# EAGLE design TPA3255 (EAGLE 9.2.2)
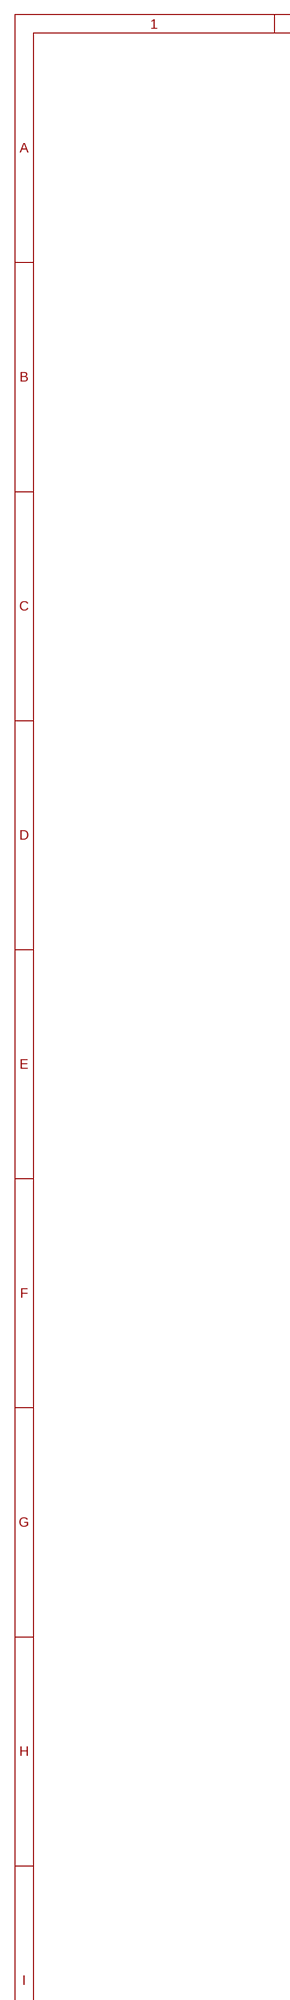
[diagram p0: schematic, sheet 1, part 1 of 2]
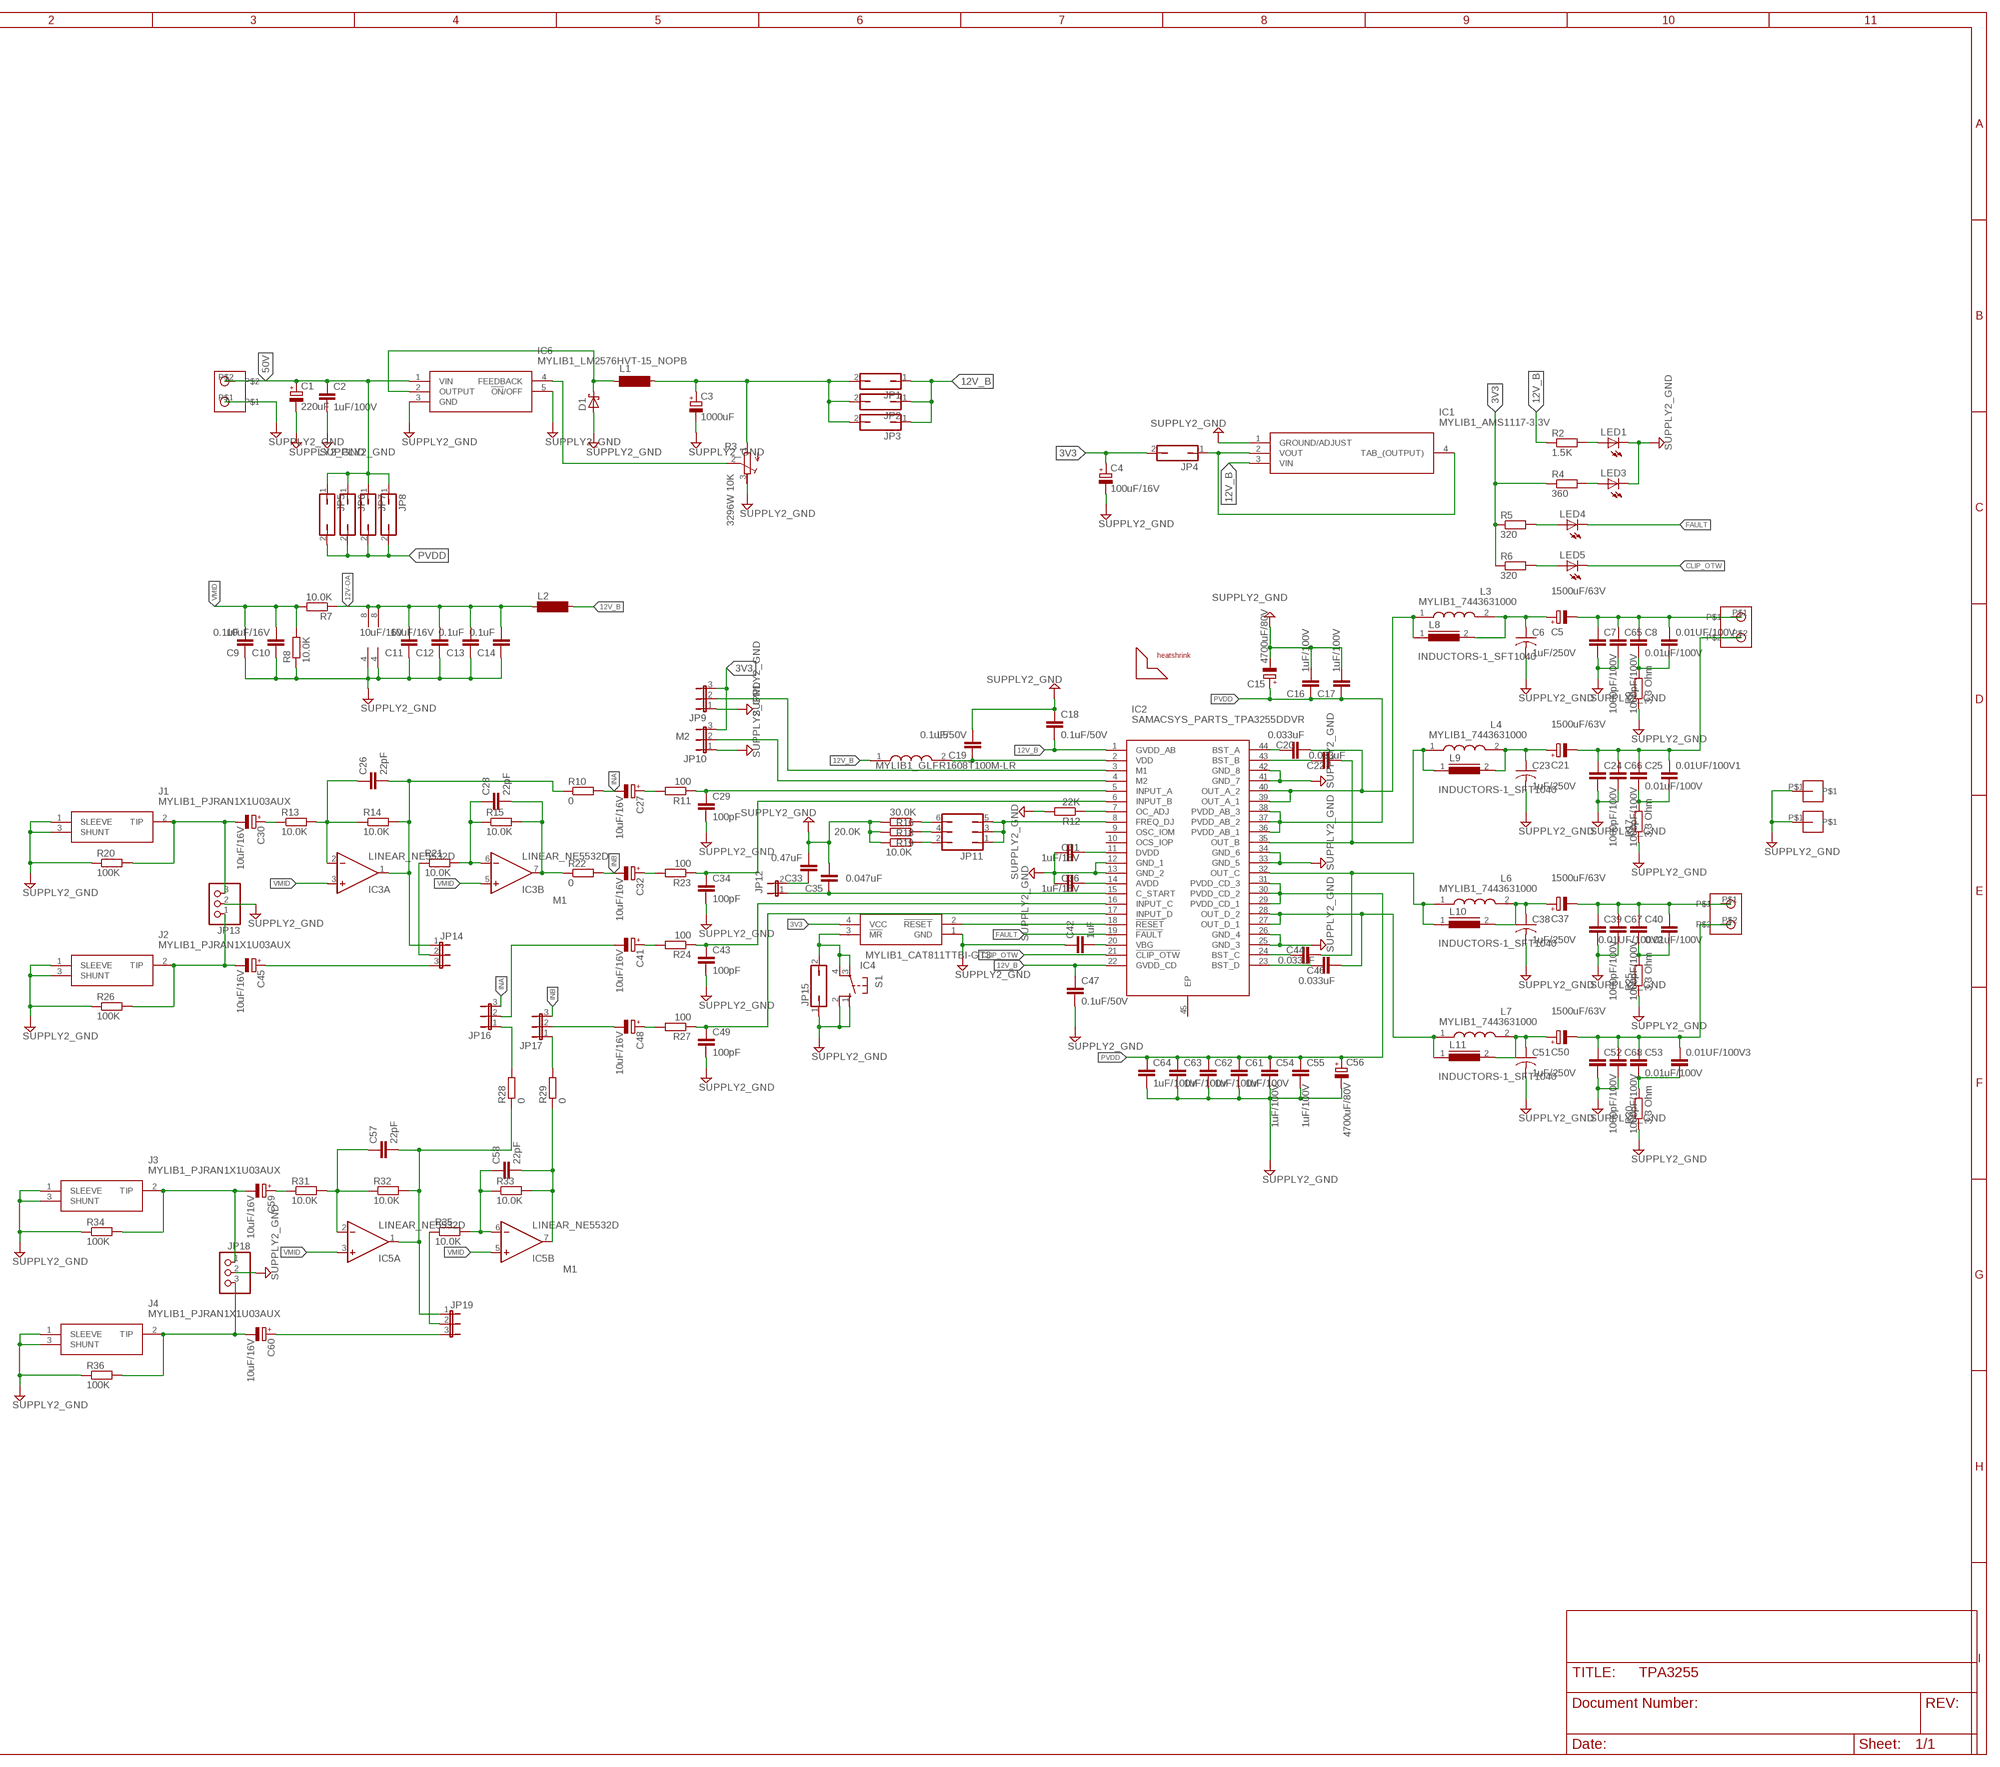
[diagram p1: schematic, sheet 1, part 2 of 2]

## Parts
0.01UF/100V  RCL_C-EU102-054X133  [RCL_C102-054X133]
0.01UF/100V1  RCL_C-EU102-054X133  [RCL_C102-054X133]
0.01UF/100V2  RCL_C-EU102-054X133  [RCL_C102-054X133]
0.01UF/100V3  RCL_C-EU102-054X133  [RCL_C102-054X133]
C1  220uF  RCL_CPOL-EUE7.5-18  [RCL_E7,5-18]
C2  1uF/100V  RCL_C-EU150-054X183  [RCL_C150-054X183]
C3  1000uF  RCL_CPOL-EUE5-10.5  [RCL_E5-10,5]
C4  100uF/16V  RESISTOR_CPOL-EUB:1  [RESISTOR_PANASONIC_B:1]
C5  1500uF/63V  RCL_CPOL-EUE10-22.5  [RCL_EB22,5D]
C6  1uF/250V  RCL_C-US225-108X268  [RCL_C225-108X268]
C7  1000pF/100V  RCL_C-EUC1206  [RCL_C1206]
C8  0.01uF/100V  RCL_C-EUC0603  [RCL_C0603]
C9  0.1uF  RCL_C-EUC0805  [RCL_C0805]
C10  10uF/16V  RCL_C-EUC0805  [RCL_C0805]
C11  10uF/16V  RCL_C-EUC0805  [RCL_C0805]
C12  10uF/16V  RCL_C-EUC0805  [RCL_C0805]
C13  0.1uF  RCL_C-EUC0805  [RCL_C0805]
C14  0.1uF  RCL_C-EUC0805  [RCL_C0805]
C15  4700uF/80V  RCL_CPOL-EUE10-35  [RCL_EB35D]
C16  1uF/100V  RCL_C-EU150-054X183  [RCL_C150-054X183]
C17  1uF/100V  RCL_C-EU150-054X183  [RCL_C150-054X183]
C18  0.1uF/50V  RCL_C-EUC0603  [RCL_C0603]
C19  0.1uF/50V  RCL_C-EUC0603  [RCL_C0603]
C20  0.033uF  RCL_C-EUC0603K  [RCL_C0603K]
C21  1500uF/63V  RCL_CPOL-EUE10-22.5  [RCL_EB22,5D]
C22  0.033uF  RCL_C-EUC0603K  [RCL_C0603K]
C23  1uF/250V  RCL_C-US225-108X268  [RCL_C225-108X268]
C24  1000pF/100V  RCL_C-EUC1206  [RCL_C1206]
C25  0.01uF/100V  RCL_C-EUC0603  [RCL_C0603]
C26  22pF  RCL_C-EUC0805  [RCL_C0805]
C27  10uF/16V  RCL_CPOL-EUB  [RCL_PANASONIC_B]
C28  22pF  RCL_C-EUC0805  [RCL_C0805]
C29  100pF  RCL_C-EUC0805  [RCL_C0805]
C30  10uF/16V  RCL_CPOL-EUB  [RCL_PANASONIC_B]
C31  1uF/16V  RCL_C-EUC0603  [RCL_C0603]
C32  10uF/16V  RCL_CPOL-EUB  [RCL_PANASONIC_B]
C33  0.47uF  RCL_C-EUC0603  [RCL_C0603]
C34  100pF  RCL_C-EUC0805  [RCL_C0805]
C35  0.047uF  RCL_C-EUC0805  [RCL_C0805]
C36  1uF/16V  RCL_C-EUC0603  [RCL_C0603]
C37  1500uF/63V  RCL_CPOL-EUE10-22.5  [RCL_EB22,5D]
C38  1uF/250V  RCL_C-US225-108X268  [RCL_C225-108X268]
C39  1000pF/100V  RCL_C-EUC1206  [RCL_C1206]
C40  0.01uF/100V  RCL_C-EUC0603  [RCL_C0603]
C41  10uF/16V  RCL_CPOL-EUB  [RCL_PANASONIC_B]
C42  1uF  RESISTOR_C-EUC0603:1  [RESISTOR_C0603:1]
C43  100pF  RCL_C-EUC0805  [RCL_C0805]
C44  0.033uF  RCL_C-EUC0603K  [RCL_C0603K]
C45  10uF/16V  RCL_CPOL-EUB  [RCL_PANASONIC_B]
C46  0.033uF  RCL_C-EUC0603K  [RCL_C0603K]
C47  0.1uF/50V  RCL_C-EUC0603  [RCL_C0603]
C48  10uF/16V  RCL_CPOL-EUB  [RCL_PANASONIC_B]
C49  100pF  RCL_C-EUC0805  [RCL_C0805]
C50  1500uF/63V  RCL_CPOL-EUE10-22.5  [RCL_EB22,5D]
C51  1uF/250V  RCL_C-US225-108X268  [RCL_C225-108X268]
C52  1000pF/100V  RCL_C-EUC1206  [RCL_C1206]
C53  0.01uF/100V  RCL_C-EUC0603  [RCL_C0603]
C54  1uF/100V  RCL_C-EU150-054X183  [RCL_C150-054X183]
C55  1uF/100V  RCL_C-EU150-054X183  [RCL_C150-054X183]
C56  4700uF/80V  RCL_CPOL-EUE10-35  [RCL_EB35D]
C57  22pF  RCL_C-EUC0805  [RCL_C0805]
C58  22pF  RCL_C-EUC0805  [RCL_C0805]
C59  10uF/16V  RCL_CPOL-EUB  [RCL_PANASONIC_B]
C60  10uF/16V  RCL_CPOL-EUB  [RCL_PANASONIC_B]
C61  1uF/100V  RCL_C-EUC1206  [RCL_C1206]
C62  1uF/100V  RCL_C-EUC1206  [RCL_C1206]
C63  1uF/100V  RCL_C-EUC1206  [RCL_C1206]
C64  1uF/100V  RCL_C-EUC1206  [RCL_C1206]
C65  1000pF/100V  RCL_C-EU050-025X075  [RCL_C050-025X075]
C66  1000pF/100V  RCL_C-EU050-025X075  [RCL_C050-025X075]
C67  1000pF/100V  RCL_C-EU050-025X075  [RCL_C050-025X075]
C68  1000pF/100V  RCL_C-EU050-025X075  [RCL_C050-025X075]
D1  DIODE_SCHOTTKY-DIODESMD  [DIODE_SMB]
H1  28x28mm  MYLIB1_HEATSHRINK-28X28MM  [MYLIB1_HEATSHRINK-28X28MM]
IC1  MYLIB1_AMS1117-3.3V  [MYLIB1_SOT229P700X180-4N]
IC2  SAMACSYS_PARTS_TPA3255DDVR  [SAMACSYS_PARTS_SOP64P810X120-45N]
IC3  LINEAR_NE5532D  [LINEAR_SO08]
IC4  MYLIB1_CAT811TTBI-GT3  [MYLIB1_4-PIN-SOT-143(BI-SUFFIX-CASE-5]
IC5  LINEAR_NE5532D  [LINEAR_SO08]
IC6  MYLIB1_LM2576HVT-15_NOPB  [MYLIB1_LM2576HVT15NOPB]
J1  MYLIB1_PJRAN1X1U03AUX  [MYLIB1_PJRAN1X1U03AUX]
J2  MYLIB1_PJRAN1X1U03AUX  [MYLIB1_PJRAN1X1U03AUX]
J3  MYLIB1_PJRAN1X1U03AUX  [MYLIB1_PJRAN1X1U03AUX]
J4  MYLIB1_PJRAN1X1U03AUX  [MYLIB1_PJRAN1X1U03AUX]
JP1  JUMPER_JP1Q  [JUMPER_JP1]
JP2  JUMPER_JP1Q  [JUMPER_JP1]
JP3  JUMPER_JP1Q  [JUMPER_JP1]
JP4  JUMPER_JP1Q  [JUMPER_JP1]
JP5  JUMPER_JP1Q  [JUMPER_JP1]
JP6  JUMPER_JP1Q  [JUMPER_JP1]
JP7  JUMPER_JP1Q  [JUMPER_JP1]
JP8  JUMPER_JP1Q  [JUMPER_JP1]
JP9  JUMPER_JP2E  [JUMPER_JP2]
JP10  JUMPER_JP2E  [JUMPER_JP2]
JP11  JUMPER_JP3Q  [JUMPER_JP3Q]
JP12  JUMPER_JP1E  [JUMPER_JP1]
JP13  PINHEAD_PINHD-1X3  [PINHEAD_1X03]
JP14  JUMPER_JP2E  [JUMPER_JP2]
JP15  JUMPER_JP1Q  [JUMPER_JP1]
JP16  JUMPER_JP2E  [JUMPER_JP2]
JP17  JUMPER_JP2E  [JUMPER_JP2]
JP18  PINHEAD_PINHD-1X3  [PINHEAD_1X03]
JP19  JUMPER_JP2E  [JUMPER_JP2]
L1  INDUCTOR-NEOSID_BS11  [INDUCTOR-NEOSID_BS11]
L2  INDUCTOR-NEOSID_BS11  [INDUCTOR-NEOSID_BS11]
L3  MYLIB1_7443631000  [MYLIB1_WE-HCF_201322]
L4  MYLIB1_7443631000  [MYLIB1_WE-HCF_201322]
L5  MYLIB1_GLFR1608T100M-LR  [MYLIB1_INDC1608X100N]
L6  MYLIB1_7443631000  [MYLIB1_WE-HCF_201322]
L7  MYLIB1_7443631000  [MYLIB1_WE-HCF_201322]
L8  INDUCTORS-1_SFT1040  [INDUCTORS-1_SFT1040]
L9  INDUCTORS-1_SFT1040  [INDUCTORS-1_SFT1040]
L10  INDUCTORS-1_SFT1040  [INDUCTORS-1_SFT1040]
L11  INDUCTORS-1_SFT1040  [INDUCTORS-1_SFT1040]
LED1  LED_LEDCHIP-LED0805  [LED_CHIP-LED0805]
LED3  LED_LEDCHIP-LED0805  [LED_CHIP-LED0805]
LED4  LED_LEDCHIP-LED0805  [LED_CHIP-LED0805]
LED5  LED_LEDCHIP-LED0805  [LED_CHIP-LED0805]
R2  1.5K  RCL_R-EU_M0805  [RCL_M0805]
R3  3296W 10K  RCL_R-TRIMM3296W  [RCL_RTRIM3296W]
R4  360  RCL_R-EU_M0805  [RCL_M0805]
R5  320  RCL_R-EU_M0805  [RCL_M0805]
R6  320  RCL_R-EU_M0805  [RCL_M0805]
R7  10.0K  RESISTOR_R-EU_M0805:1  [RESISTOR_M0805:1]
R8  10.0K  RESISTOR_R-EU_M0805:1  [RESISTOR_M0805:1]
R9  3.3 Ohm  RESISTOR_R-EU_R0805:1  [RESISTOR_R0805:1]
R10  0  RESISTOR_R-EU_M0805:1  [RESISTOR_M0805:1]
R11  100  RCL_R-EU_M0805  [RCL_M0805]
R12  22K  RCL_R-EU_M0805  [RCL_M0805]
R13  10.0K  RESISTOR_R-EU_M0805:1  [RESISTOR_M0805:1]
R14  10.0K  RESISTOR_R-EU_M0805:1  [RESISTOR_M0805:1]
R15  10.0K  RESISTOR_R-EU_M0805:1  [RESISTOR_M0805:1]
R16  30.0K  RCL_R-EU_R0805  [RCL_R0805]
R17  3.3 Ohm  RESISTOR_R-EU_R0805:1  [RESISTOR_R0805:1]
R18  20.0K  RESISTOR_R-EU_R0603:1  [RESISTOR_R0603:1]
R19  10.0K  RCL_R-EU_R0805  [RCL_R0805]
R20  100K  RESISTOR_R-EU_M0805:1  [RESISTOR_M0805:1]
R21  10.0K  RESISTOR_R-EU_M0805:1  [RESISTOR_M0805:1]
R22  0  RESISTOR_R-EU_M0805:1  [RESISTOR_M0805:1]
R23  100  RCL_R-EU_M0805  [RCL_M0805]
R24  100  RCL_R-EU_M0805  [RCL_M0805]
R25  3.3 Ohm  RESISTOR_R-EU_R0805:1  [RESISTOR_R0805:1]
R26  100K  RESISTOR_R-EU_M0805:1  [RESISTOR_M0805:1]
R27  100  RCL_R-EU_M0805  [RCL_M0805]
R28  0  RESISTOR_R-EU_M0805:1  [RESISTOR_M0805:1]
R29  0  RESISTOR_R-EU_M0805:1  [RESISTOR_M0805:1]
R30  3.3 Ohm  RESISTOR_R-EU_R0805:1  [RESISTOR_R0805:1]
R31  10.0K  RESISTOR_R-EU_M0805:1  [RESISTOR_M0805:1]
R32  10.0K  RESISTOR_R-EU_M0805:1  [RESISTOR_M0805:1]
R33  10.0K  RESISTOR_R-EU_M0805:1  [RESISTOR_M0805:1]
R34  100K  RESISTOR_R-EU_M0805:1  [RESISTOR_M0805:1]
R35  10.0K  RESISTOR_R-EU_M0805:1  [RESISTOR_M0805:1]
R36  100K  RESISTOR_R-EU_M0805:1  [RESISTOR_M0805:1]
S1  SWITCH-OMRON_10-XX  [SWITCH-OMRON_B3F-10XX]
T1  MYLIB1_5MM-2PIN-TERMINAL  [MYLIB1_3MM-2PIN-TERMINAL]
T2  MYLIB1_5MM-2PIN-TERMINAL  [MYLIB1_3MM-2PIN-TERMINAL]
T4  MYLIB1_5MM-2PIN-TERMINAL  [MYLIB1_3MM-2PIN-TERMINAL]
U$1  MYLIB1_5MM-1PIN-TERMINAL  [MYLIB1_5MM-1PIN-TERMINAL]
U$2  MYLIB1_5MM-1PIN-TERMINAL  [MYLIB1_5MM-1PIN-TERMINAL]

## Nets
3V3: C4.+ IC4.4(VCC) JP4.2 JP9.3 JP10.3 R4.1 R5.1 R6.1
12V: C3.+ JP1.2 JP2.2 JP3.2 L1.2 R3.1(A)
12V-OA: C11.2 C12.2 C13.2 C14.2 IC3.8(P:V+) IC5.8(P:V+) L2.1 R7.1
12V_B: C18.2 C47.1 IC1.3(VIN) IC2.1(GVDD_AB) IC2.22(GVDD_CD) JP1.1 JP2.1 JP3.1 L2.2 L5.1 R2.1
50V: C1.+ C2.1 IC6.1(VIN) JP5.1 JP6.1 JP7.1 JP8.1 T1.P$2
CLIP_OTW: IC2.21(!CLIP_OTW) LED5.C
FAULT: IC2.19(!FAULT) LED4.C
GND: C1.- C2.2 C3.- C4.- C6.2 C7.2 C9.1 C10.1 C11.1 C12.1 C13.1 C14.1 C15.- C16.2 C17.2 C18.1 C19.2 C23.2 C24.2 C29.2 C31.1 C33.2 C34.2 C35.2 C36.1 C38.2 C39.2 C42.1 C43.2 C47.2 C49.2 C51.2 C52.2 C54.2 C55.2 C56.- C61.2 C62.2 C63.2 C64.2 C65.2 C66.2 C67.2 C68.2 D1.A IC1.1(GROUND/ADJUST) IC2.12(GND_1) IC2.13(GND_2) IC2.25(GND_3) IC2.26(GND_4) IC2.33(GND_5) IC2.34(GND_6) IC2.41(GND_7) IC2.42(GND_8) IC3.4(P:V-) IC4.1(GND) IC5.4(P:V-) IC6.3(GND) IC6.5(!ON!/OFF) J1.1(SLEEVE) J1.3(SHUNT) J2.1(SLEEVE) J2.3(SHUNT) J3.1(SLEEVE) J3.3(SHUNT) J4.1(SLEEVE) J4.3(SHUNT) JP9.1 JP10.1 JP13.2 JP15.1 JP18.2 LED1.C LED3.C R3.3(E) R8.1 R9.1 R12.2 R16.1 R17.1 R18.1 R19.1 R20.1 R25.1 R26.1 R30.1 R34.1 R36.1 S1.1(S) S1.2(S1) T1.P$1 U$1.P$1 U$2.P$1 ; supply symbol labelled SUPPLY2_GND
INA: C27.- JP16.3 R10.2
INB: C32.- JP17.3 R22.2
N$1: C34.1 IC2.6(INPUT_B) R23.1
N$2: C43.1 IC2.16(INPUT_C) R24.1
N$3: C49.1 IC2.17(INPUT_D) R27.1
N$4: IC2.3(M1) JP9.2
N$5: C29.1 IC2.5(INPUT_A) R11.1
N$6: IC2.4(M2) JP10.2
N$7: C35.1 IC2.15(C_START) JP12.1
N$8: IC2.7(OC_ADJ) R12.1
N$9: C33.1 JP12.2
N$10: IC4.3(!MR) JP15.2 S1.3(P) S1.4(P1)
N$11: LED4.A R5.2
N$12: LED5.A R6.2
N$13: C42.2 IC2.20(VBG)
N$14: C44.1 IC2.24(BST_C)
N$15: C46.1 IC2.23(BST_D)
N$16: C22.1 IC2.43(BST_B)
N$17: IC2.18(!RESET) IC4.2(!RESET)
N$18: C20.1 IC2.44(BST_A)
N$19: 0.01UF/100V.2 C8.2 R9.2
N$20: C5.+ C6.1 L3.2 L8.2
N$21: 0.01UF/100V.1 C5.- C7.1 C8.1 C65.1 T2.P$1
N$22: C20.2 IC2.39(OUT_A_1) IC2.40(OUT_A_2) L3.1 L8.1
N$23: 0.01UF/100V1.2 C25.2 R17.2
N$24: C21.+ C23.1 L4.2 L9.2
N$25: 0.01UF/100V1.1 C21.- C24.1 C25.1 C66.1 T2.P$2
N$26: C22.2 IC2.35(OUT_B) L4.1 L9.1
N$27: 0.01UF/100V2.1 C40.2 R25.2
N$28: C37.+ C38.1 L6.2 L10.2
N$29: 0.01UF/100V2.2 C37.- C39.1 C40.1 C67.1 T4.P$1
N$30: JP11.6 R16.2
N$31: 0.01UF/100V3.2 C53.2 R30.2
N$32: C50.+ C51.1 L7.2 L11.2
N$33: 0.01UF/100V3.1 C50.- C52.1 C53.1 C68.1 T4.P$2
N$34: C44.2 IC2.32(OUT_C) L6.1 L10.1
N$35: C46.2 IC2.27(OUT_D_1) IC2.28(OUT_D_2) L7.1 L11.1
N$36: IC2.8(FREQ_DJ) JP11.1 JP11.3 JP11.5
N$37: JP11.4 R18.2
N$38: JP11.2 R19.2
N$39: C36.2 IC2.14(AVDD)
N$40: C31.2 IC2.11(DVDD)
N$41: C30.+ R13.1
N$42: LED3.A R4.2
N$43: C19.1 IC2.2(VDD) L5.2
N$44: IC1.2(VOUT) IC1.4(TAB_(OUTPUT)) JP4.1
N$45: D1.C IC6.2(OUTPUT) L1.1
N$46: IC6.4(FEEDBACK) R3.2(S)
N$48: LED1.A R2.2
N$49: C45.+ JP14.3
N$50: C26.1 IC3.2(A:-IN) R13.2 R14.1
N$51: C26.2 IC3.1(A:OUT) JP14.1 R10.1 R14.2
N$52: JP14.2 R21.1
N$53: C28.1 IC3.6(B:-IN) R15.1 R21.2
N$54: C28.2 IC3.7(B:OUT) R15.2 R22.1
N$55: JP17.1 R29.2
N$56: C27.+ R11.2
N$57: C48.- JP17.2
N$58: C32.+ R23.2
N$59: C59.+ R31.1
N$60: C57.1 IC5.2(A:-IN) R31.2 R32.1
N$61: C57.2 IC5.1(A:OUT) JP19.1 R28.1 R32.2
N$62: C60.+ JP19.3
N$63: JP19.2 R35.1
N$64: C58.1 IC5.6(B:-IN) R33.1 R35.2
N$65: C58.2 IC5.7(B:OUT) R29.1 R33.2
N$66: JP16.1 R28.2
N$67: C41.- JP16.2
N$68: C48.+ R27.2
N$69: C41.+ R24.2
N$70: C30.- J1.2(TIP) JP13.3 R20.2
N$71: C45.- J2.2(TIP) JP13.1 R26.2
N$72: C59.- J3.2(TIP) JP18.1 R34.2
N$73: C60.- J4.2(TIP) JP18.3 R36.2
PVDD: C15.+ C16.1 C17.1 C54.1 C55.1 C56.+ C61.1 C62.1 C63.1 C64.1 IC2.29(PVDD_CD_1) IC2.30(PVDD_CD_2) IC2.31(PVDD_CD_3) IC2.36(PVDD_AB_1) IC2.37(PVDD_AB_2) IC2.38(PVDD_AB_3) JP5.2 JP6.2 JP7.2 JP8.2
VMID: C9.2 C10.2 IC3.3(A:+IN) IC3.5(B:+IN) IC5.3(A:+IN) IC5.5(B:+IN) R7.2 R8.2
Unconnected: IC2.9(OSC_IOM) IC2.10(OCS_IOP) IC2.45(EP)

## Notes on the sheet
- M2
- M1
- M1

## Library data of the parts
0.01UF/100V 0.01UF/100V1-0.01UF/100V3 C2 C7-C14 C16-C20 C22 C24-C26 C28 C29 C31 C33-C36 C39 C40 C43 C44 C46 C47 C49 C52-C55 C57 C58 C61-C68 = TPA3255:RCL_C-EU: CAPACITOR, European symbol; SPICEPREFIX: C
C1 C3 C5 C15 C21 C27 C30 C32 C37 C41 C45 C48 C50 C56 C59 C60 = TPA3255:RCL_CPOL-EU: POLARIZED CAPACITOR, European symbol; SPICEPREFIX: C
C4 = TPA3255:RESISTOR_CPOL-EU*?:1: POLARIZED CAPACITOR, European symbol
C6 C23 C38 C51 = TPA3255:RCL_C-US: CAPACITOR, American symbol; SPICEPREFIX: C
C42 = TPA3255:RESISTOR_C-EU*?:1: CAPACITOR, European symbol
D1 = TPA3255:DIODE_SCHOTTKY-DIODE: Schottky Diode
H1 = TPA3255:MYLIB1_HEATSHRINK-28X28MM
IC1 = TPA3255:MYLIB1_AMS1117-3.3V: 1A LOW DROPOUT VOLTAGE REGULATOR, SOT-223 Source: Datasheet <http://www.advanced-monolithic.com/pdf/ds1117.pdf>; DESCRIPTION: 1A LOW DROPOUT VOLTAGE REGULATOR, SOT-223; HEIGHT: 1.8mm; MANUFACTURER_NAME: Advanced Monolithic Systems; MANUFACTURER_PART_NUMBER: ams1117-3.3v
IC2 = TPA3255:SAMACSYS_PARTS_TPA3255DDVR: 315W Stereo / 600W Mono PurePath Ultra-HD, Analog-In Class-D Amplifier Source: Datasheet <http://www.ti.com/lit/gpn/tpa3255>; ARROW_PART_NUMBER: TPA3255DDVR; DESCRIPTION: 315W Stereo / 600W Mono PurePath Ultra-HD, Analog-In Class-D Amplifier; HEIGHT: 1.2mm; MANUFACTURER_NAME: Texas Instruments; MANUFACTURER_PART_NUMBER: TPA3255DDVR
IC3 IC5 = TPA3255:LINEAR_NE5532: AUDIO AMPLIFIER
IC4 = TPA3255:MYLIB1_CAT811TTBI-GT3: uP PSU Supervisory IC Vth=3.075V SOT-143 ON Semiconductor CAT811TTBI-GT3, Voltage Supervisor 2.5V, 3V, 3.3V, 5V, Reset Input, 4-Pin SOT-143 Source: Datasheet <http://www.onsemi.com/pub/Collateral/CAT811-D.PDF>; ALLIED_NUMBER: 70339532; ALLIED_PRICE-STOCK: http://www.alliedelec.com/on-semiconductor-cat811ttbi-gt3/70339532/; DESCRIPTION: uP PSU Supervisory IC Vth=3.075V SOT-143 ON Semiconductor CAT811TTBI-GT3, Voltage Supervisor 2.5V, 3V, 3.3V, 5V, Reset Input, 4-Pin SOT-143; HEIGHT: mm; MANUFACTURER_NAME: ON Semiconductor; MANUFACTURER_PART_NUMBER: CAT811TTBI-GT3; MOUSER_PART_NUMBER: 698-CAT811TTBI-GT3; MOUSER_PRICE-STOCK: https://www.mouser.com/Search/Refine.aspx?Keyword=698-CAT811TTBI-GT3; RS_PART_NUMBER: 7893929P; RS_PRICE-STOCK: http://uk.rs-online.com/web/p/products/7893929P
IC6 = TPA3255:MYLIB1_LM2576HVT-15_NOPB: Texas Instruments, LM2576HVT-15/NOPB Step-Down Switching Regulator 3A, 14.25 15.83 V, 5-Pin TO-220 Source: Datasheet <https://componentsearchengine.com/Datasheets/2/LM2576HVT-15_NOPB.pdf>; DESCRIPTION: Texas Instruments, LM2576HVT-15/NOPB Step-Down Switching Regulator 3A, 14.25 15.83 V, 5-Pin TO-220; HEIGHT: 16.11mm; MANUFACTURER_NAME: Texas Instruments; MANUFACTURER_PART_NUMBER: LM2576HVT-15/NOPB; MOUSER_PART_NUMBER: 926-LM2576HVT-15NOPB; MOUSER_PRICE-STOCK: https://www.mouser.com/Search/Refine.aspx?Keyword=926-LM2576HVT-15NOPB; RS_PART_NUMBER: 1628191; RS_PRICE-STOCK: http://uk.rs-online.com/web/p/products/1628191
J1-J4 = TPA3255:MYLIB1_PJRAN1X1U03AUX: RCA Phono Connectors 1 POS RA PHONO JACK Source: Datasheet <http://www.switchcraft.com/Drawings/pjran1x1u__x_series_cd.pdf>; DESCRIPTION: RCA Phono Connectors 1 POS RA PHONO JACK; HEIGHT: 13mm; MANUFACTURER_NAME: Switchcraft; MANUFACTURER_PART_NUMBER: PJRAN1X1U03AUX; MOUSER_PART_NUMBER: 502-PJRAN1X1U03AUX; MOUSER_PRICE-STOCK: https://www.mouser.com/Search/Refine.aspx?Keyword=502-PJRAN1X1U03AUX
JP1-JP8 JP15 = TPA3255:JUMPER_JP1Q: JUMPER
JP9 JP10 JP14 JP16 JP17 JP19 = TPA3255:JUMPER_JP2E: JUMPER
JP11 = TPA3255:JUMPER_JP3Q: JUMPER
JP12 = TPA3255:JUMPER_JP1E: JUMPER
JP13 JP18 = TPA3255:PINHEAD_PINHD-1X3: PIN HEADER
L1 L2 = TPA3255:INDUCTOR-NEOSID_BS: INDUCTOR nominal inductance, magnetically screened; OC_FARNELL: unknown; OC_NEWARK: unknown
L3 L4 L6 L7 = TPA3255:MYLIB1_7443631000: Wurth WE-HCF Series Shielded Wire-wound SMD Inductor with a Ferrite Core, 10 H 15% Flat Wire Winding 23A Idc Source: Datasheet; DESCRIPTION: Wurth WE-HCF Series Shielded Wire-wound SMD Inductor with a Ferrite Core, 10 H 15% Flat Wire Winding 23A Idc; HEIGHT: mm; MANUFACTURER_NAME: Wurth Elektronik; MANUFACTURER_PART_NUMBER: 7443631000; MOUSER_PART_NUMBER: 710-7443631000; MOUSER_PRICE-STOCK: https://www.mouser.com/Search/Refine.aspx?Keyword=710-7443631000; RS_PART_NUMBER: 7445047P; RS_PRICE-STOCK: http://uk.rs-online.com/web/p/products/7445047P
L5 = TPA3255:MYLIB1_GLFR1608T100M-LR: TDK - GLFR1608T100M-LR - POWER LINE IND, 10UH,400MA,20% Source: Datasheet <https://componentsearchengine.com/Datasheets/2/GLFR1608T100M-LR.pdf>; DESCRIPTION: TDK - GLFR1608T100M-LR - POWER LINE IND, 10UH,400MA,20%; HEIGHT: 1mm; MANUFACTURER_NAME: TDK; MANUFACTURER_PART_NUMBER: GLFR1608T100M-LR; MOUSER_PART_NUMBER: 810-GLFR1608T100M-LR; MOUSER_PRICE-STOCK: https://www.mouser.com/Search/Refine.aspx?Keyword=810-GLFR1608T100M-LR; RS_PART_NUMBER: 6446626; RS_PRICE-STOCK: http://uk.rs-online.com/web/p/products/6446626
L8-L11 = TPA3255:INDUCTORS-1_SFT1040: INDUCTOR; SPICEPREFIX: L
LED1 LED3-LED5 = TPA3255:LED_LED: LED OSRAM: - CHIPLED LG R971, LG N971, LY N971, LG Q971, LY Q971, LO R971, LY R971 LH N974, LH R974 LS Q976, LO Q976, LY Q976 LO Q996 - Hyper CHIPLED LW Q18S LB Q993, LB Q99A, LB R99A - SideLED LS A670, LO A670, LY A670, LG A670, LP A670 LB A673, LV A673, LT A673, LW A673 LH A674 LY A675 LS A676, LA A676, LO A676, LY A676, LW A676 LS A679, LY A679, LG A679 - Hyper Micro SIDELED® LS Y876, LA Y876, LO Y876, LY Y876 LT Y87S - SmartLED LW L88C, LW L88S LB L89C, LB L89S, LG L890 LS L89K, LO L89K, LY L89K LS L896, LA L896, LO L896, LY L896 - TOPLED LS T670, LO T670, LY T670, LG T670, LP T670 LSG T670, LSP T670, LSY T670, LOP T670, LYG T670 LG T671, LOG T671, LSG T671 LB T673, LV T673, LT T673, LW T673 LH T674 LS T676, LA T676, LO T676, LY T676, LB T676, LH T676, LSB T676, LW T676 LB T67C, LV T67C, LT T67C, LS T67K, LO T67K, LY T67K, LW E67C LS E67B, LA E67B, LO E67B, LY E67B, LB E67C, LV E67C, LT E67C LW T67C LS T679, LY T679, LG T679 LS T770, LO T770, LY T770, LG T770, LP T770 LB T773, LV T773, LT T773, LW T773 LH T774 LS E675, LA E675, LY E675, LS T675 LS T776, LA T776, LO T776, LY T776, LB T776 LHGB T686 LT T68C, LB T68C - Hyper Mini TOPLED® LB M676 - Mini TOPLED Santana® LG M470 LS M47K, LO M47K, LY M47K Source: http://www.osram.convergy.de LUXEON: - LUMILED® LXK2-PW12-R00, LXK2-PW12-S00, LXK2-PW14-U00, LXK2-PW14-V00 LXK2-PM12-R00, LXK2-PM12-S00, LXK2-PM14-U00 LXK2-PE12-Q00, LXK2-PE12-R00, LXK2-PE12-S00, LXK2-PE14-T00, LXK2-PE14-U00 LXK2-PB12-K00, LXK2-PB12-L00, LXK2-PB12-M00, LXK2-PB14-N00, LXK2-PB14-P00, LXK2-PB14-Q00 LXK2-PR12-L00, LXK2-PR12-M00, LXK2-PR14-Q00, LXK2-PR14-R00 LXK2-PD12-Q00, LXK2-PD12-R00, LXK2-PD12-S00 LXK2-PH12-R00, LXK2-PH12-S00 LXK2-PL12-P00, LXK2-PL12-Q00, LXK2-PL12-R00 Source: www.luxeon.com KINGBRIGHT: KA-3528ASYC Source: www.kingbright.com
R2 R4-R6 R11 R12 R16 R19 R23 R24 R27 = TPA3255:RCL_R-EU_: RESISTOR, European symbol; SPICEPREFIX: R
R3 = TPA3255:RCL_R-TRIMM: Trimm resistor; SPICEMODEL: X; SPICEPREFIXL: POT
R7-R10 R13-R15 R17 R18 R20-R22 R25 R26 R28-R36 = TPA3255:RESISTOR_R-EU_*?:1: RESISTOR, European symbol
S1 = TPA3255:SWITCH-OMRON_10-XX: OMRON SWITCH; MPN: B3F-1000; OC_FARNELL: 176432; OC_NEWARK: 36M3542
T1 T2 T4 = TPA3255:MYLIB1_5MM-2PIN-TERMINAL
U$1 U$2 = TPA3255:MYLIB1_5MM-1PIN-TERMINAL

## Board
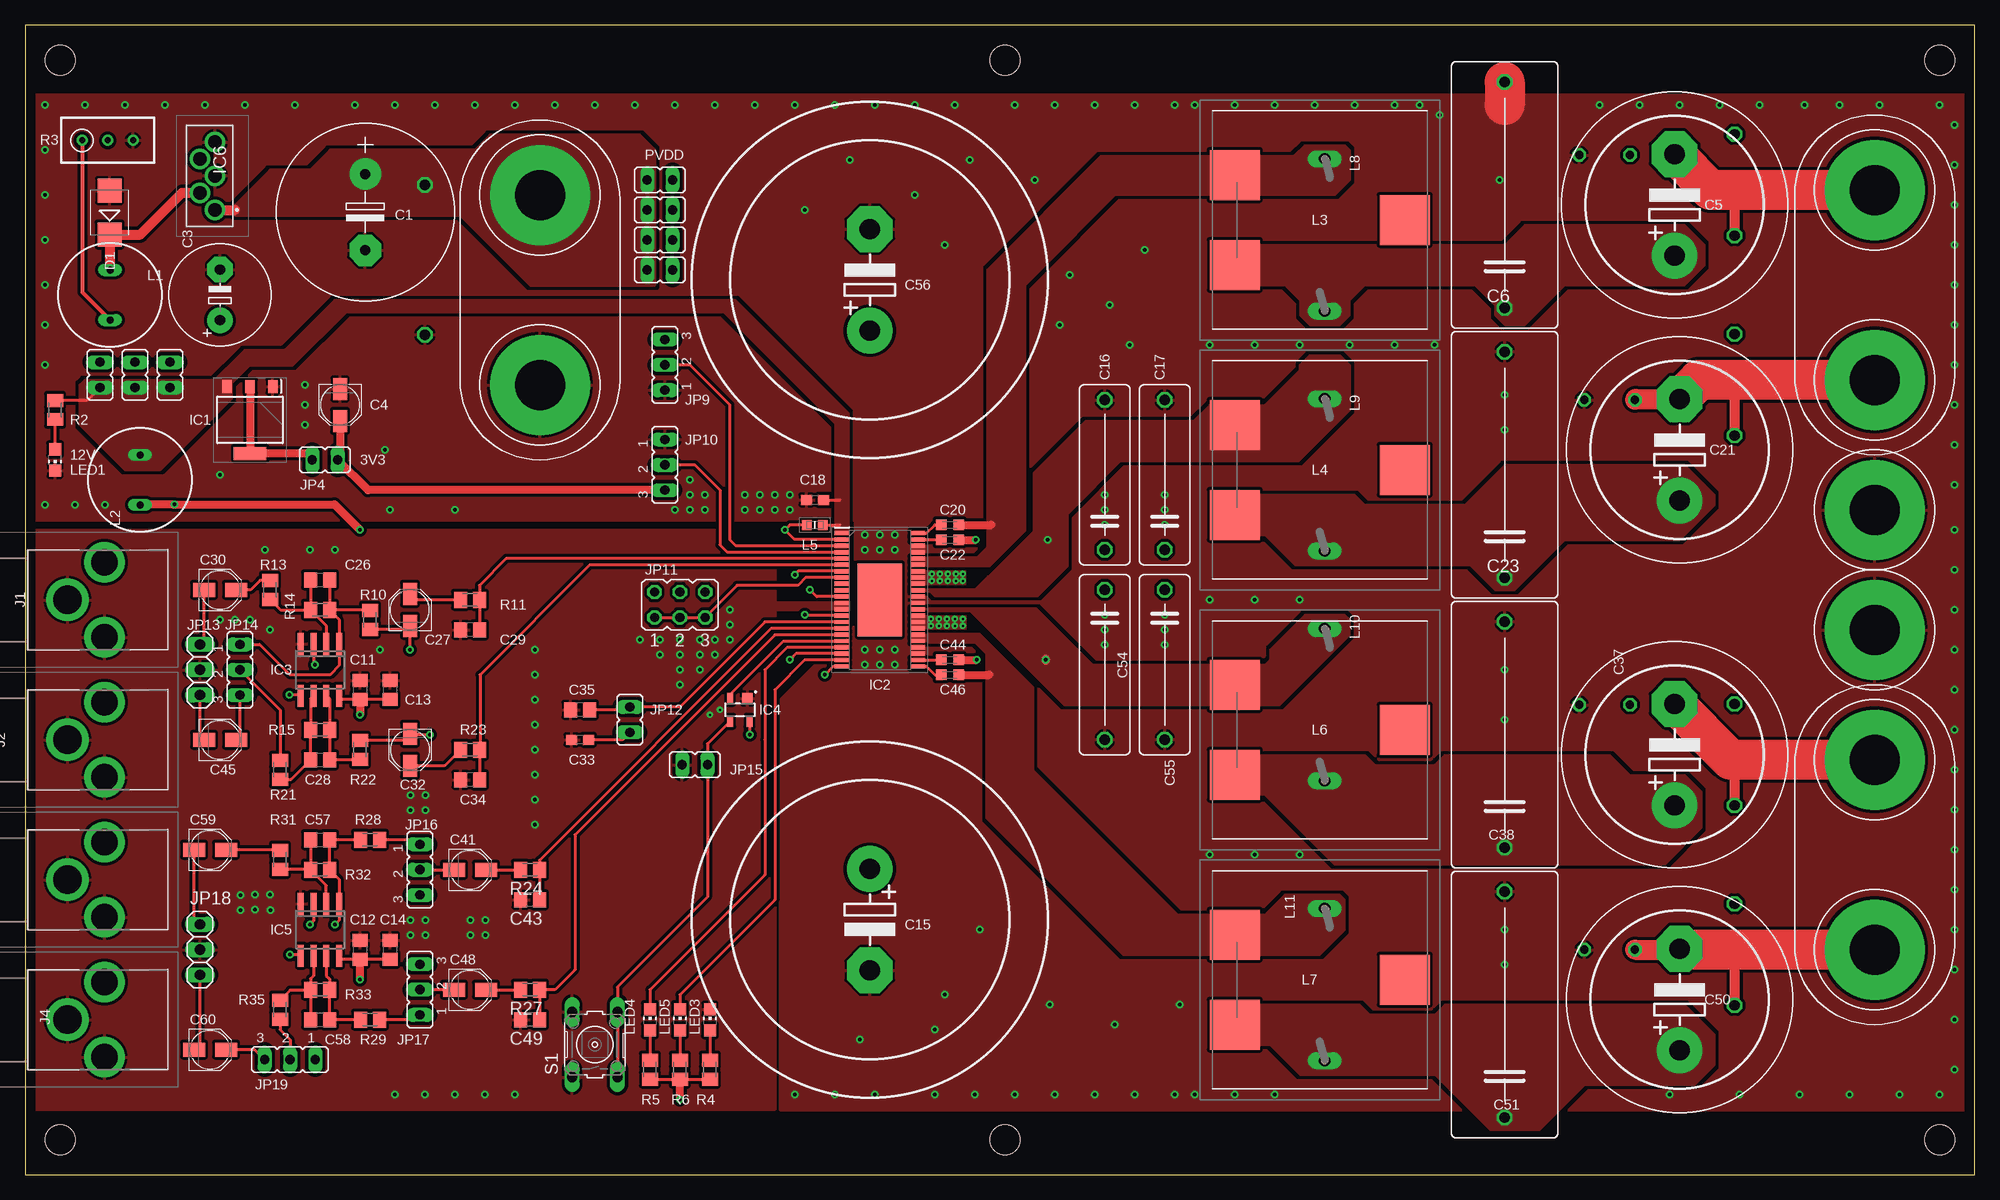
[diagram p2: board, top side]
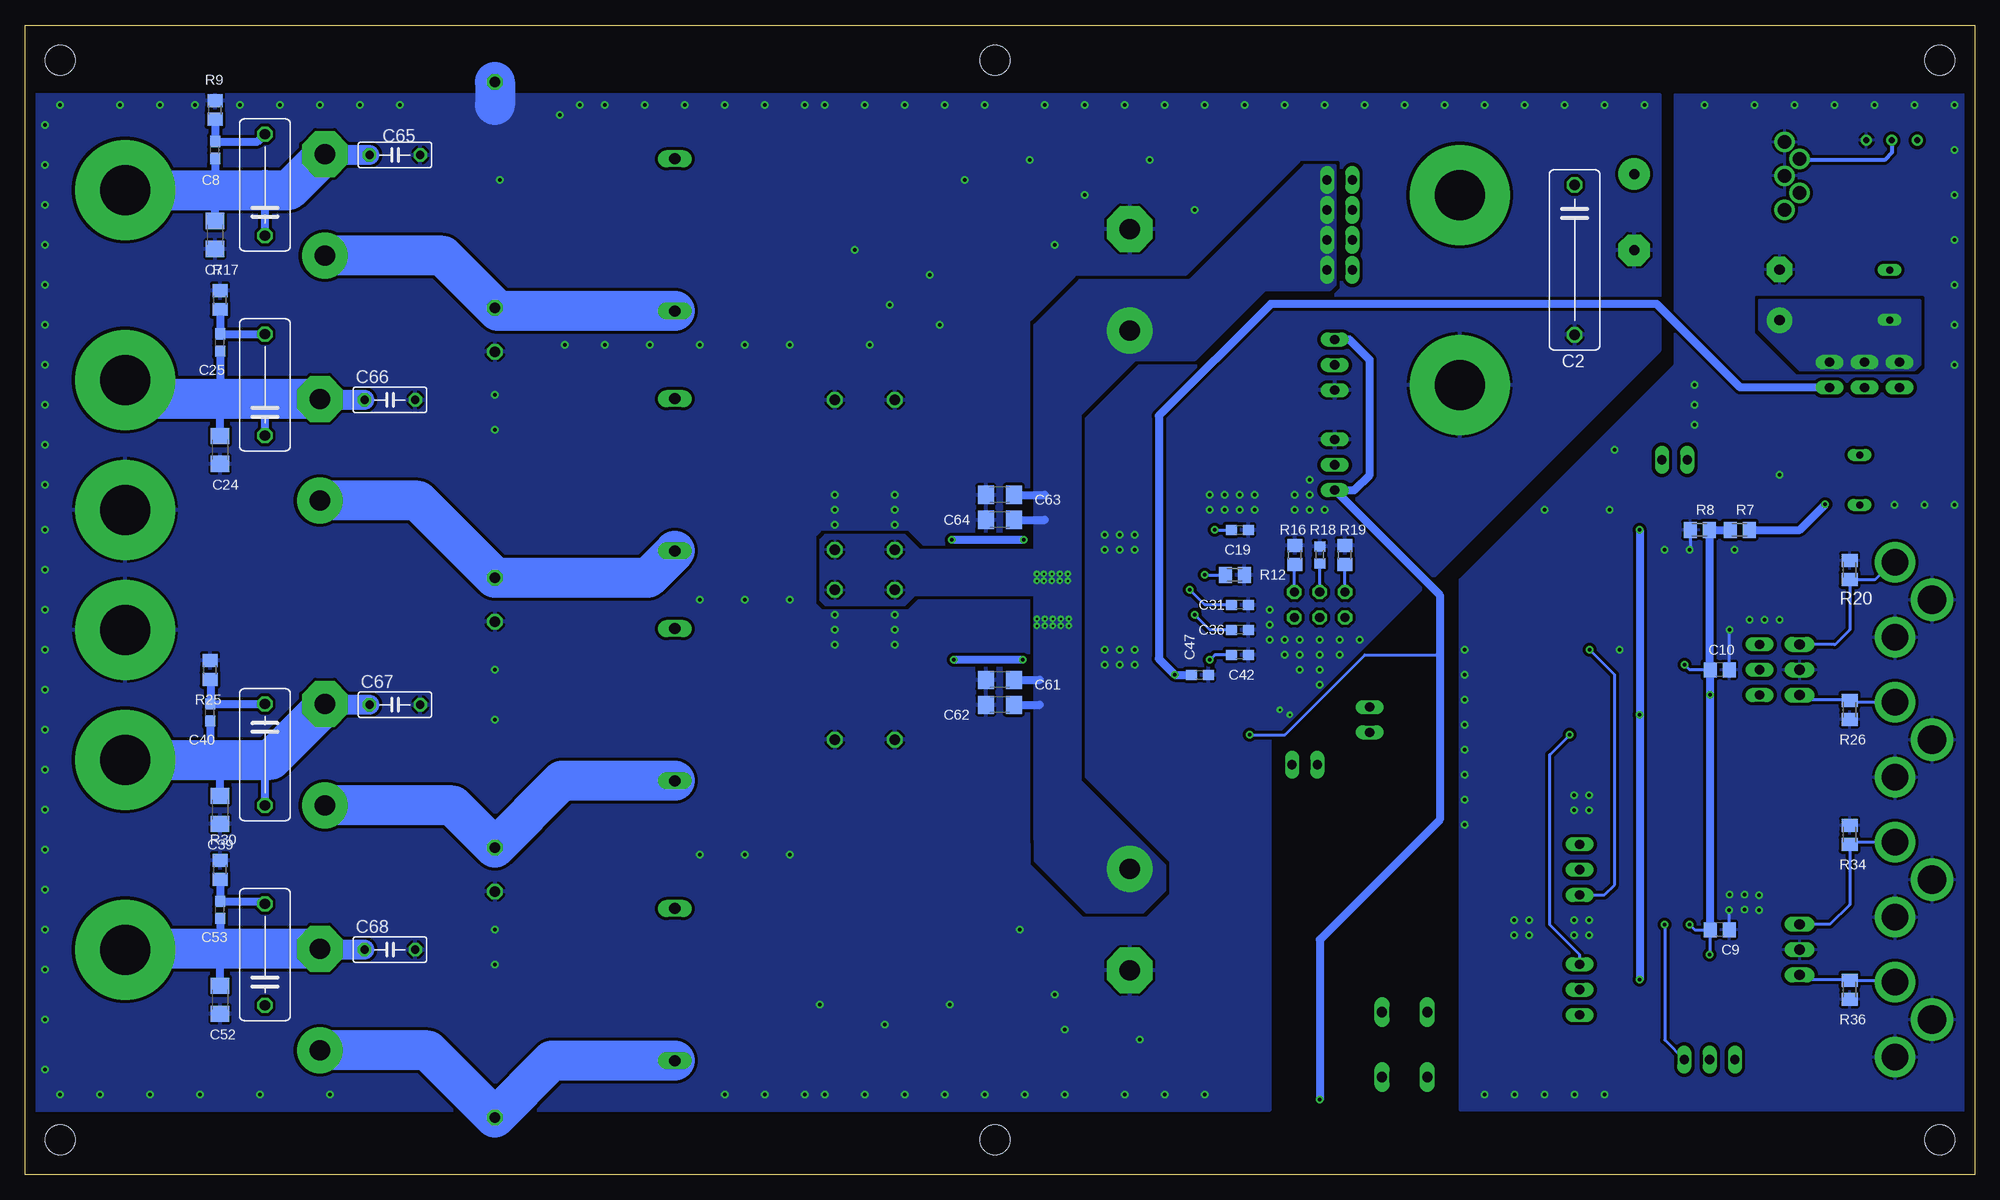
[diagram p3: board, bottom side, seen from below]

Size 195 x 115 mm. Coordinates in mm from the lower left corner, seen from the top.
Outline: 0,0 195,0 195,115 0,115 0,0
Copper layers (1*16): Top 0.035mm / dielectric 1.5mm / Bottom 0.035mm
Design rules "default *": minimum track width 6mil, minimum drill 0.2mm, track to track 6mil, track to pad 6mil, pad to pad 6mil, via to via 6mil, smd to smd 6mil, copper to edge 40mil, drill to drill 6mil, minimum pad ring 10mil, minimum via ring 8mil, stop-mask expansion 4mil, vias tented up to drill 0mil, thermal gap 10mil
Holes 3 mm at 3.5,111.5 3.5,3.5 191.5,3.5 191.5,111.5 98,111.5 98,3.5

### Footprints (pad centres in the part's own frame; a part is rotated, then mirrored left to right if it is on the bottom)
RCL_C102-054X133 = drill 1.016 octagon: 1 -5.08,0; 2 5.08,0
RCL_E7,5-18 = drill 1.016 pad 3.15: + -3.81,0 | drill 1.016 pad 3.15 octagon: - 3.81,0
RCL_C150-054X183 = drill 1.016 octagon: 1 -7.493,0; 2 7.493,0
RCL_E5-10,5 = drill 1.016 pad 2.54: + -2.54,0 | drill 1.016 pad 2.54 octagon: - 2.54,0
RESISTOR_PANASONIC_B:1 = smd 2.2 x 1.4: + 1.6,0; - -1.6,0
RCL_EB22,5D = drill 2.007 pad 4.597: + -5.08,0 | drill 2.007 pad 4.597 octagon: - 5.08,0
RCL_C225-108X268 = drill 1.016 octagon: 1 -11.303,0; 2 11.303,0
RCL_C1206 = smd 1.6 x 1.8: 1 -1.4,0; 2 1.4,0
RCL_C0603 = smd 1.1 x 1: 1 -0.85,0; 2 0.85,0
RCL_C0805 = smd 1.3 x 1.5: 1 -0.95,0; 2 0.95,0
RCL_EB35D = drill 2.007 pad 4.597: + -5.08,0 | drill 2.007 pad 4.597 octagon: - 5.08,0
RCL_C0603K = smd 1.05 x 1.08: 1 -0.875,0; 2 0.875,0
RCL_PANASONIC_B = smd 2.2 x 1.4: + 1.6,0; - -1.6,0
RESISTOR_C0603:1 = smd 1.1 x 1: 1 -0.85,0; 2 0.85,0
RCL_C050-025X075 = drill 0.813 octagon: 1 -2.54,0; 2 2.54,0
DIODE_SMB = smd 2.4 x 2.4: A 2.2,0; C -2.2,0
MYLIB1_SOT229P700X180-4N = smd 1.3 x 0.95: 1 -3.35,2.29; 2 -3.35,0; 3 -3.35,-2.29 | smd 1.3 x 3.25: 4 3.35,0
SAMACSYS_PARTS_SOP64P810X120-45N = smd 1.475 x 0.435: 1 -3.788,6.668; 2 -3.788,6.032; 3 -3.788,5.398; 4 -3.788,4.762; 5 -3.788,4.128; 6 -3.788,3.492; 7 -3.788,2.858; 8 -3.788,2.222; 9 -3.788,1.588; 10 -3.788,0.952; 11 -3.788,0.318; 12 -3.788,-0.318; 13 -3.788,-0.952; 14 -3.788,-1.588; 15 -3.788,-2.222; 16 -3.788,-2.858; 17 -3.788,-3.492; 18 -3.788,-4.128; 19 -3.788,-4.762; 20 -3.788,-5.398; 21 -3.788,-6.032; 22 -3.788,-6.668; 23 3.788,-6.668; 24 3.788,-6.032; 25 3.788,-5.398; 26 3.788,-4.762; 27 3.788,-4.128; 28 3.788,-3.492; 29 3.788,-2.858; 30 3.788,-2.222; 31 3.788,-1.588; 32 3.788,-0.952; 33 3.788,-0.318; 34 3.788,0.318; 35 3.788,0.952; 36 3.788,1.588; 37 3.788,2.222; 38 3.788,2.858; 39 3.788,3.492; 40 3.788,4.128; 41 3.788,4.762; 42 3.788,5.398; 43 3.788,6.032; 44 3.788,6.668 | smd 4.43 x 7.3: 45 0,0
LINEAR_SO08 = smd 0.6 x 2.2: 1 -1.905,-2.6; 2 -0.635,-2.6; 3 0.635,-2.6; 4 1.905,-2.6; 5 1.905,2.6; 6 0.635,2.6; 7 -0.635,2.6; 8 -1.905,2.6
MYLIB1_4-PIN-SOT-143(BI-SUFFIX-CASE-5 = smd 1.05 x 1.1: 1 -0.76,-1.15 | smd 0.6 x 1.1: 2 0.96,-1.15; 3 0.96,1.15; 4 -0.96,1.15
MYLIB1_LM2576HVT15NOPB = drill 1.39 pad 2: 1 0,0; 2 1.7,1.5; 3 3.4,0; 4 5.1,1.5; 5 6.8,0
MYLIB1_PJRAN1X1U03AUX = drill 2.818 pad 4.227: 1 0,1.75 | drill 2.693 pad 4.039: 2 -3.75,5.45; 3 3.75,5.45
JUMPER_JP1 = drill 0.914 long: 1 0,-1.27; 2 0,1.27
JUMPER_JP2 = drill 0.914 long: 1 -2.54,0; 2 0,0; 3 2.54,0
JUMPER_JP3Q = drill 0.914 octagon: 1 -2.54,-1.27; 2 -2.54,1.27; 3 0,-1.27; 4 0,1.27; 5 2.54,-1.27; 6 2.54,1.27
PINHEAD_1X03 = drill 1.016 long: 1 -2.54,0; 2 0,0; 3 2.54,0
INDUCTOR-NEOSID_BS11 = drill 0.7 long: 1 -2.5,0; 2 2.5,0
MYLIB1_WE-HCF_201322 = smd 5 x 5: 1 -8.5,4.5; 2 -8.5,-4.5; 3 8.5,0
MYLIB1_INDC1608X100N = smd 0.95 x 1: 1 -0.8,0; 2 0.8,0
INDUCTORS-1_SFT1040 = drill 1.118 long: 1 -7.62,0; 2 7.62,0
LED_CHIP-LED0805 = smd 1.2 x 1.2: A 0,-1.05; C 0,1.05
RCL_M0805 = smd 1.3 x 1.6: 1 -0.95,0; 2 0.95,0
RCL_RTRIM3296W = drill 0.61: 1 0,-2.54; 2 0,0; 3 0,2.54
RESISTOR_M0805:1 = smd 1.3 x 1.6: 1 -0.95,0; 2 0.95,0
RESISTOR_R0805:1 = smd 1.3 x 1.5: 1 -0.95,0; 2 0.95,0
RCL_R0805 = smd 1.3 x 1.5: 1 -0.95,0; 2 0.95,0
RESISTOR_R0603:1 = smd 1 x 1.1: 1 -0.85,0; 2 0.85,0
SWITCH-OMRON_B3F-10XX = drill 1.016 long: 1 -3.251,2.261; 2 3.251,2.261; 3 -3.251,-2.261; 4 3.251,-2.261
MYLIB1_3MM-2PIN-TERMINAL = drill 5 pad 10: P$1 -9.5,0; P$2 9.5,0
MYLIB1_5MM-1PIN-TERMINAL = drill 5 pad 10: P$1 0,0

### Placement (x,y rotation side)
0.01UF/100V  171,99 90 bottom
0.01UF/100V1  171,79 90 bottom
0.01UF/100V2  171,42 270 bottom
0.01UF/100V3  171,22 90 bottom
C1  34.04,96.27 270 top
C2  40,91.5 270 bottom
C3  19.5,88 90 top
C4  31.5,77 270 top
C5  165,97 90 top
C6  148,98 90 top
C7  176,94 270 bottom
C8  176,102.5 90 bottom
C9  25.5,24.5 180 bottom
C10  25.5,50.5 180 bottom
C11  33.5,48.5 270 top
C12  33.5,22.5 270 top
C13  36.5,48.5 270 top
C14  36.5,22.5 270 top
C15  84.5,25.5 270 top
C16  108,70 90 top
C17  114,70 90 top
C18  79,67.5 0 top
C19  73.5,64.5 0 bottom
C20  92.5,65 0 top
C21  165.5,72.5 90 top
C22  92.5,63.5 0 top
C23  148,71 90 top
C24  175.5,72.5 270 bottom
C25  175.5,83.25 90 bottom
C26  29.5,59.5 0 top
C27  38.5,56.5 90 top
C28  29.5,41.5 0 top
C29  44.5,54.5 180 top
C30  19.5,58.5 0 top
C31  73.5,57 180 bottom
C32  38.5,42.5 270 top
C33  55.5,43.5 180 top
C34  44.5,39.5 180 top
C35  55.5,46.5 180 top
C36  73.5,54.5 180 bottom
C37  165,42 90 top
C38  148,44 90 top
C39  175.5,36.5 270 bottom
C40  176.5,46.25 90 bottom
C41  44.5,30.5 0 top
C42  73.5,52 180 bottom
C43  50.5,27.5 180 top
C44  92.5,51.5 0 top
C45  19.5,43.5 0 top
C46  92.5,50 0 top
C47  77.5,50 0 bottom
C48  44.5,18.5 0 top
C49  50.5,15.5 180 top
C50  165.5,17.5 90 top
C51  148,17 90 top
C52  175.5,17.5 270 bottom
C53  175.5,26.5 90 bottom
C54  108,51 270 top
C55  114,51 270 top
C56  84.5,89.5 90 top
C57  29.5,33.5 0 top
C58  29.5,15.5 0 top
C59  18.5,32.5 0 top
C60  18.5,12.5 0 top
C61  97.5,49.5 180 bottom
C62  97.5,47 180 bottom
C63  97.5,68 180 bottom
C64  97.5,65.5 180 bottom
C65  158,102 0 bottom
C66  158.5,77.5 0 bottom
C67  158,47 0 bottom
C68  158.5,22.5 0 bottom
D1  8.46,96.23 90 top
H1  85.5,57.5 0 top
IC1  22.5,75.5 270 top
IC2  85.5,57.5 0 top
IC3  29.5,50.5 180 top
IC4  71.5,46.5 180 top
IC5  29.5,24.5 180 top
IC6  19,96.5 90 top
J1  2.5,57.5 270 top
J2  2.5,43.5 270 top
J3  2.5,29.5 270 top
J4  2.5,15.5 270 top
JP1  11,80 0 top
JP2  14.5,80 0 top
JP3  7.5,80 0 top
JP4  30,71.5 270 top
JP5  63.5,99.5 270 top
JP6  63.5,96.5 270 top
JP7  63.5,93.5 270 top
JP8  63.5,90.5 270 top
JP9  64,81 90 top
JP10  64,71 270 top
JP11  65.5,57 0 top
JP12  60.5,45.5 180 top
JP13  17.5,50.5 90 top
JP14  21.5,50.5 270 top
JP15  67,41 270 top
JP16  39.5,30.5 270 top
JP17  39.5,18.5 90 top
JP18  17.5,22.5 270 top
JP19  26.5,11.5 180 top
L1  8.5,88 270 top
L2  11.5,69.5 90 top
L3  129.5,95.5 0 top
L4  129.5,70.5 0 top
L5  79,65 180 top
L6  129.5,44.5 0 top
L7  129.5,19.5 0 top
L8  130,94 270 top
L9  130,70 270 top
L10  130,47 270 top
L11  130,19 270 top
LED1  3,71.5 180 top
LED3  68.5,15.5 0 top
LED4  62.5,15.5 0 top
LED5  65.5,15.5 0 top
R2  3,76.5 270 top
R3  8.27,103.46 270 top
R4  68.5,10.5 90 top
R5  62.5,10.5 90 top
R6  65.5,10.5 90 top
R7  23.5,64.5 180 bottom
R8  27.5,64.5 0 bottom
R9  176,106.5 270 bottom
R10  34.5,55.5 270 top
R11  44.5,57.5 180 top
R12  74,60 0 bottom
R13  24.5,58.5 270 top
R14  29.5,56.5 0 top
R15  29.5,44.5 0 top
R16  68,62 270 bottom
R17  175.5,87.5 270 bottom
R18  65.5,62 270 bottom
R19  63,62 270 bottom
R20  12.5,60.5 270 bottom
R21  25.5,40.5 270 top
R22  33.5,42.5 90 top
R23  44.5,42.5 180 top
R24  50.5,30.5 180 top
R25  176.5,50.5 270 bottom
R26  12.5,46.5 90 bottom
R27  50.5,18.5 180 top
R28  34.5,33.5 0 top
R29  34.5,15.5 0 top
R30  175.5,30.5 270 bottom
R31  25.5,31.5 270 top
R32  29.5,30.5 0 top
R33  29.5,18.5 0 top
R34  12.5,34 270 bottom
R35  25.5,16.5 90 top
R36  12.5,18.5 90 bottom
S1  57,13 90 top
T1  51.5,88.5 90 top
T2  185,89 270 top
T4  185,32 270 top
U$1  185,54.5 0 top
U$2  185,66.5 0 top

### Tracks (layer width: path | path; a pad name or v marks a point on that pad's centre or on a via)
3V3  (via drill 0.35)
  Top 0.305: R5.1 R6.1 R4.1 | IC4.4 72.46,44.04 v72.5,44
  Top 0.813: C4.+ 31.5,71.73 JP4.2 34.31,68.46 JP10.3 | 63.96,83.5 JP9.3 | v65.5,7.5 R6.1
  Bottom 0.305: v72.5,44 69,44 61,52 53.5,52
  Bottom 0.813: JP9.3 62.54,83.54 60.5,81.5 60.5,70 62.04,68.46 JP10.3 53.5,57.96 53.5,52 53.5,35.5 65.5,23.5 v65.5,7.5
12V
  Top 0.406: R3.1 5.73,88.27 L1.2
  pour Bottom (isolate 0.305, rank 3, no thermals): 5.5,87.5 5.5,81 6,80.5 17.5,80.5 21.5,84.5 21.5,87.5
12V-OA  (via drill 0.35)
  Top 0.305: C13.2 C11.2 31.75,47.55 IC3.8 | C14.2 C12.2 31.75,21.55 IC5.8
  Top 0.813: v14.93,67.05 30.95,67.05 v33.5,64.5 | v33.5,19.5 C12.2 | C11.2 v33.5,46 | v14.93,67.05 14.88,67 | v14.93,67.05 11.55,67.05 L2.1
  Bottom 0.813: R7.1 17.48,64.5 v14.93,67.05 | v33.5,64.5 v33.5,46 v33.5,19.5
12V_B  (via drill 0.35)
  Top 0.305: IC2.22 80.83,50.83 v80,50 | C18.2 81.5,67.5 | L5.1 81.5,65 | JP3.1 6.22,77.45 R2.1
  Bottom 0.813: JP2.1 23.43,78.73 31.8,87.1 70.4,87.1 81.6,75.9 81.6,51.6 v80,50 C47.1
  pour Top (isolate 0.305, rank 3, no thermals): 6,79.5 20.6,79.5 20.6,77.6 13.5,70.5 10,70.5 5.5,75 5.5,79
  pour Top (isolate 0.305, no thermals): 18.4,78.9 22,82.5 26,82.5 31,87.5 71,87.5 82.3,76.2 82.3,64.3 82.1,64.1 81.5,64.1 81.1,64.5 81.1,75.1 69.9,86.3 32.1,86.3 26.7,80.9 22.4,80.9 20.4,78.9
50V
  Top 1.016: IC6.1 21,96.5
  pour Top (isolate 0.305, rank 3, no thermals): 45,102.5 30.5,102.5 28.5,100.5 24.5,100.5 21,97 21,96 43.5,96 50.5,89 63,89 63,102.5 61.5,104 46.5,104
CLIP_OTW
  Top 0.305: IC2.21 77.97,51.47 75,48.5 75,27.5 65.5,18 LED5.C
FAULT
  Top 0.305: IC2.19 76.24,52.74 74,50.5 74,43.5 74,30 62.5,18.5 LED4.C
GND  (via drill 0.2 pad 0.3, 0.35 pad 0.3)
  Top 4: C6.2 148,107
  Bottom 0.305: C9.1 v24.55,26.45 24.5,26.5 | C10.1 24.55,54.45 v24.5,54.5 | R8.1 28.45,62.55 v28.5,62.5
  Bottom 4: C6.2 148,107
  other vias: 68.5,46 69.5,46.5 6,107 10,107 14,107 18,107 19.5,70 22,107 27,107 36,72.5 2,107 2,102.5 2,98 2,93.5 2,89 2,85 2,81 2,67 36.5,66.5 5,67 8,67 49,8 46,8 43,8 40,8 37,8 33,107 78,96.5 37,107 82.5,101.5 41,107 89,98 28,79 28,77 28,75 69,107 147.5,99.5 73,107 109,15 77,107 45,107 108.5,87 49,107 103.5,85 53,107 104.5,90 57,107 92,93 61,107 112,92.5 65,107 110.5,83 81,107 85,107 89,107 93,107 94.5,101.5 99,107 101,99.5 103,107 107,107 111,107 115,107 117,107 121,107 125,107 129,107 133,107 137,107 139.5,107 141.5,106 157.5,107 161.5,107 165.5,107 169.5,107 173.5,107 178,107 181.5,107 185.5,107 191.5,107 81,8 91,14.5 85,8 148,50.5 148,45.5 91,8 148,24.5 95,8 148,21 99,8 148,78 103,8 148,74.5 107,8 43,66.5 111,8 102.5,17 115,8 115.5,17 117,8 95.5,24.5 121,8 92,18 125,8 164.5,8 171.5,8 177.5,8 182.5,8 187.5,8 191.5,8 69,53.5 70.5,56.5 70.5,55 70.5,53.5 69,52 67.5,53.5 67.5,52 65.5,53.5 63.5,53.5 61.5,53.5 65.5,52 63.5,52 67.5,50.5 65.5,50.5 65.5,49 51,52.5 51,50 51,47.5 51,45 51,42.5 51,40 51,37.5 51,35 35.5,52.5 31,62.5 21,55.5 24,62.5 72,66.5 73.5,66.5 75,66.5 76.5,66.5 87,62.5 87,64 85.5,64 85.5,62.5 84,62.5 84,64 87,52.5 85.5,52.5 84,52.5 84,51 85.5,51 87,51 118.5,57.5 123,57.5 118.5,32 123,32 127.5,32 118.5,83 123,83 127.5,83 132.5,83 137,83 68,68 68,66.5 66.5,68 66.5,66.5 65,66.5 66.5,69.5 193,10.5 193,15.5 193,20.5 193,24.5 193,28.5 193,32.5 193,36.5 193,40.5 193,44.5 193,48.5 193,52.5 193,56.5 193,60.5 193,64.5 193,69 193,73 193,77 193,81 193,85 193,89 193,93 193,97 193,101 193,105 108,56 108,54.5 108,53 114,56 114,54.5 114,53 114,65 114,66.5 114,68 108,65 108,66.5 108,68 141,83 127.5,57.5 83.5,13.5 77,8 76.5,68 75,68 73.5,68 72,68 22.5,55.5 19.5,55.5 24.5,28 23,28 23,26.5 21.55,27.95 21.55,26.45 40.05,25.45 38.55,25.45 38.55,23.95 40.05,23.95 44.55,25.45 46.05,25.45 46.05,23.95 44.55,23.95 38.55,37.95 40.05,37.95 40.05,36.45 38.55,36.45
  pour Bottom (isolate 0.305, rank 4): 195,108 195,6.5 70.5,6.5 70.5,43.5 31.5,82.5 31.5,108
  pour Top (isolate 0.305, no thermals): 82.4,57.3 82.4,56.45 75.15,56.45 74.3,57.3
  pour Top (isolate 0.305, rank 5): 0.5,108 0.5,65.5 83,65.5 83,55 75.5,47.5 75.5,6.5 195,6.5 195,108
  pour Top (isolate 0.305, rank 3, no thermals): 90.35,57.9 88.75,57.9 88.65,57.8 88.65,57.15 88.7,57.1 90.45,57.1 90.5,57.15 90.5,57.75
  pour Top (isolate 0.305, rank 2, no thermals): 90.3,52.85 88.35,52.85 88.15,52.65 88.15,52.1 88.25,52 90.3,52 90.45,52.15 90.45,52.7
  pour Top (isolate 0.305, rank 2, no thermals): 90.5,63 88.1,63 88.1,62.15 90.5,62.15
  pour Bottom (isolate 0.305, rank 4): 51.5,6.5 0,6.5 0,108 30,108 30,81 51.5,59.5
  pour Top (isolate 0.305, rank 3): 75,6.5 0,6.5 0,64.5 75,64.5
INA  (via drill 0.35)
  Top 0.305: R10.2 38.15,54.55 C27.- v38.5,52.5
  Bottom 0.305: JP16.3 37.04,27.96 36,29 36,50 v38.5,52.5
INB  (via drill 0.35)
  Top 0.305: C32.- 38.45,44.05 | 38.45,44.05 37.85,43.45 R22.2 | v40.5,44 38.5,44 38.45,44.05
  Bottom 0.305: JP17.3 39.5,22 42.5,25 42.5,42 v40.5,44
N$1
  Top 0.305: C34.1 R23.1 45.5,42.55 45.5,50 56.49,60.99 IC2.6
N$2
  Top 0.305: C43.1 R24.1 51.45,31.45 74.64,54.64 IC2.16
N$3
  Top 0.305: C49.1 R27.1 53,18.5 55,20.5 55,34 75,54 IC2.17
N$4
  Top 0.305: IC2.3 71.1,62.9 70.5,63.5 70.5,77 66.5,81 JP9.2
N$5
  Top 0.305: C29.1 R11.1 45.45,58.95 48.13,61.63 IC2.5
N$6
  Top 0.305: IC2.4 70.24,62.26 69.5,63 69.5,68.5 67,71 JP10.2
N$7
  Top 0.305: IC2.15 74.01,55.28 65.5,46.77 JP12.1 60.23,46.5 C35.1
N$8  (via drill 0.35)
  Top 0.305: IC2.7 77.36,60.36 v77,60
  Bottom 0.305: v77,60 R12.1
N$9
  Top 0.305: JP12.2 59.77,43.5 C33.1
N$10
  Top 0.305: IC4.3 68.27,43.08 JP15.2 68.27,27.77 59.26,18.76 S1.4 S1.3
N$11
  Top 0.305: LED4.A R5.2
N$12
  Top 0.305: LED5.A R6.2
N$13  (via drill 0.35)
  Top 0.305: IC2.20 77.1,52.1 v76.5,51.5
  Bottom 0.305: C42.2 76,52 v76.5,51.5
N$14
  Top 0.305: IC2.24 89.32,51.5 C44.1
N$15
  Top 0.305: IC2.23 90.17,50.83 91,50 C46.1
N$16
  Top 0.305: IC2.43 91.59,63.53 C22.1
N$17
  Top 0.305: IC2.18 75.87,53.37 70.54,48.04 IC4.2
N$18
  Top 0.305: IC2.44 90.17,64.17 91,65 C20.1
N$19
  Bottom 0.813: C8.2 175.9,103.45 | R9.2 C8.2 | C8.2 171.73,103.35 0.01UF/100V.2
N$20
  Bottom 4: L8.2 147.68,86.38 C6.1 153.22,91.92 C5.+
  pour Top (isolate 0.305, rank 2, no thermals): 148,93 119,93 119,89 166,89 168,91 168,93 166,95 150,95
  pour Top (isolate 0.305, no thermals): 145,89 147,87 147,86 148,85 150,85 154,89
  pour Top (isolate 0.305, no thermals): 126,89 127.5,87.5 127.5,86 128.5,85 131.5,85 132.5,86 132.5,87.5 134,89
N$21
  Top 1.016: 0.01UF/100V.1 171,98.5
  Top 4: T2.P$1 171,98.5 168.58,98.5 C5.-
  Bottom 0.813: C7.1 176,98.5 C8.1 | 0.01UF/100V.1 171,98.5
  Bottom 2: C65.1 164.92,102 C5.-
  Bottom 4: 184.19,99.31 T2.P$1 176,98.5 171,98.5 168.58,98.5 C5.-
N$22
  Top 0.813: C20.2 96.65,65
  pour Top (isolate 0.254, no thermals): 95.2,61.75 88.65,61.75 88.65,60.9 96.5,60.9 100.05,64.45 100.05,89 110.28,99.22 107.6,101.9 96.2,90.5 96.2,62.75
  pour Top (isolate 0.305, no thermals): 107.6,101.9 126.9,101.9 128,103 132,103 132.5,102.5 132.5,99.5 131,98 109,98 107.6,99.4
N$23
  Top 1.016: 171.03,84.05 0.01UF/100V1.2
  Bottom 0.813: R17.2 C25.2 175.48,84.08 0.01UF/100V1.2
N$24
  Bottom 4: L9.2 132.68,59.7 C23.1 155.72,67.42 C21.+
  pour Top (isolate 0.305, no thermals): 119,68 119,64 124,64 127,61 144.5,61 147,58.5 149,58.5 154,63.5 165.5,63.5 169,67 169,68 166,71 148,71 144,67 134,67 133,68
N$25
  Top 0.813: 175.5,80 175,79.5 175.25,79.25 | C21.- 165.42,77.58 165,78
  Top 1.016: 165,78 165,78.67 | 0.01UF/100V1.1 171,78.5 171.5,79 171,79.5
  Top 2: C66.1 161.12,77.58 165.42,77.58
  Top 4: 184.81,79.31 T2.P$2 175,79.5 171,79.5 167.42,79.5 C21.-
  Bottom 0.813: C25.1 175.5,77.58 C24.1 | 0.01UF/100V1.1 171,77.58
  Bottom 2: C66.1 165.42,77.5 C21.-
  Bottom 4: C21.- 171,77.58 175.5,77.58 183.08,77.58 T2.P$2
N$26  (via drill 0.35, 0.35 pad 0.3)
  Top 0.813: C22.2 v95.1,63.5
  Bottom 0.813: v95.1,63.5 v102.3,63.5
  pour Top (isolate 0.254, no thermals): 89.95,58.55 89.95,58.35 90.5,58.35 90.95,57.9 101.3,57.9 104.3,60.9 104.3,66.1 109.85,71.65 106.1,75.4 100.85,70.15 100.85,64.35 96.3,59.8 96.3,59.85 95,58.55
  pour Top (isolate 0.305, no thermals): 106.1,75.4 116.9,75.4 118.5,77 124,77 127.5,80.5 127.5,81 128.5,82 131.5,82 132.5,81 132.5,76.5 127.35,71.35 109.65,71.35 106.1,74.9
N$27
  Top 1.016: 171.03,47.05 0.01UF/100V2.1
  Bottom 0.813: 0.01UF/100V2.1 171.02,47.1 C40.2 176.45,47.05 176.45,49.5 R25.2
N$28
  Bottom 4: L10.2 141.32,39.38 C38.1 152.22,36.92 C37.+
  pour Top (isolate 0.305, no thermals): 123,42 134,42 135,41 141,41 142,42 158.5,42 160.5,40 166,40 167.7,38.3 167.7,34.7 164,31 131,31 124,38 123,38
N$29
  Top 0.813: 176.5,43 175,41.5
  Top 1.016: 0.01UF/100V2.2 171,41.08 170.58,41.5
  Top 4: T4.P$1 175,41.5 170.58,41.5 C37.-
  Bottom 0.813: 175.25,38.15 C39.1 175.5,40.5 176.5,41.5 C40.1 | 0.01UF/100V2.2 171,40.92 170.42,41.5
  Bottom 2: C67.1 164.92,47
  Bottom 4: C37.- 164.92,47 170.42,41.5 176.5,41.5 T4.P$1
N$30
  Bottom 0.305: JP11.6 68.04,61.01 R16.2
N$31
  Bottom 0.813: 0.01UF/100V3.2 171.27,27.35 C53.2 R30.2
N$32
  Bottom 4: L11.2 142.32,11.38 C51.1 154.72,12.42 C50.+
  pour Top (isolate 0.305, no thermals): 123,17 123,13 124.5,13 127.5,10 141,10 146.5,4.5 151.5,4.5 156,9 167,9 169,11 169,14 166,17 142,17 141,16 134.5,16 133.5,17
N$33
  Top 0.813: 175.5,22 176,22.5 176,23 175.75,23.25
  Top 1.016: 0.01UF/100V3.1 171,22.5
  Top 2: C68.1 165.58,22.5
  Top 4: T4.P$2 176,22.5 171,22.5 165.58,22.5 C50.- 165.34,22.58
  Bottom 0.813: C52.1 175.5,22.58 C53.1
  Bottom 2: C68.1 165.42,22.5 C50.-
  Bottom 4: C50.- 175.5,22.58 184.92,22.58 T4.P$2
N$34  (via drill 0.35, 0.35 pad 0.3)
  Top 0.813: C44.2 v95.2,51.5 | 102.1,51.6 v102.1,51.5 102.1,51.4
  Bottom 0.813: v95.2,51.5 v102.1,51.5
  pour Top (isolate 0.305, no thermals): 89.5,56.65 89.5,56.4 94.5,56.4 103.9,47 110.8,47 101.15,56.65
  pour Top (isolate 0.305, no thermals): 109.1,47 125.5,47 132.5,54 132.5,55.5 132,56 128,56 124.5,52.5 124.5,51.5 124,51 106.5,51 106.5,49.6
N$35
  Top 0.813: C46.2 96.45,50 | L7.1 120.5,24
  pour Top (isolate 0.305, no thermals): 95.5,54.1 88.65,54.1 88.65,53.25 95,53.25 96.1,52.15 96.1,35.7 100.85,40.45 100.85,48.75
  pour Top (isolate 0.305, no thermals): 96.1,35.7 109.8,22 129.5,22 132,24.5 132,27.5 131.5,28 126,28 124,26 115.3,26 100.85,40.45
N$36
  Top 0.305: JP11.1 JP11.3 68,55.73 | 68,55.73 JP11.5 | IC2.8 78.07,59.72 77.3,58.95 71.22,58.95 68,55.73
N$37
  Bottom 0.305: JP11.4 R18.2
N$38
  Bottom 0.305: JP11.2 62.96,61.01 R19.2
N$39  (via drill 0.35)
  Top 0.305: IC2.14 78.09,55.91 v78,56
  Bottom 0.305: C36.2 76.5,54.5 v78,56
N$40  (via drill 0.35)
  Top 0.305: IC2.11 79.18,57.82 v78.5,58.5
  Bottom 0.305: C31.2 77,57 v78.5,58.5
N$41
  Top 0.305: C30.+ 22.55,58.5 23.5,59.45 R13.1
N$42
  Top 0.305: LED3.A R4.2
N$43  (via drill 0.35)
  Top 0.305: IC2.2 76.97,63.53 v76,64.5 76.5,65 L5.2
  Bottom 0.305: v76,64.5 C19.1
N$44
  Top 0.813: JP4.1 28.08,72.15 IC1.4 IC1.2
N$45
  Top 1.016: L1.1 8.46,90.54 D1.C 11.53,94.03 15.7,98.2 IC6.2
N$46
  Bottom 0.4: R3.2 8.27,102.23 9,101.5 17.4,101.5 IC6.4
N$48
  Top 0.305: LED1.A R2.2
N$49
  Top 0.305: C45.+ 21.5,43.9 JP14.3
N$50
  Top 0.305: C26.1 R14.1 | R14.1 30.14,54.91 IC3.2 | R13.2 25.55,56.5 R14.1
N$51
  Top 0.305: R10.1 34.45,56.5 R14.2 | C26.2 R14.2 | R14.2 31.41,55.55 IC3.1 31.41,50.91 30.5,50 26.5,50 23.46,53.04 JP14.1
N$52
  Top 0.305: JP14.2 25.5,46.5 R21.1
N$53
  Top 0.305: R21.2 26.6,39.55 C28.1 R15.1 28.55,47.59 IC3.6
N$54
  Top 0.305: R22.1 30.5,41.55 C28.2 R15.2 30.45,47.59 IC3.7
N$55
  Top 0.305: JP17.1 39.04,15.5 R29.2
N$56
  Top 0.305: R11.2 39.1,57.5 C27.+
N$57
  Top 0.305: C48.- JP17.2
N$58
  Top 0.305: R23.2 41.95,40.9 C32.+
N$59
  Top 0.305: R31.1 25.45,32.5 C59.+
N$60
  Top 0.305: R32.1 28.5,30.55 R31.2 | C57.1 R32.1 | IC5.2 30.14,28.91 R32.1
N$61  (via drill 0.35)
  Top 0.305: R28.1 C57.2 R32.2 31.41,29.55 IC5.1 31.41,25.41 v31,25
  Bottom 0.305: v31,25 31,13.46 JP19.1
N$62
  Top 0.305: JP19.3 22.96,12.5 C60.+
N$63
  Top 0.305: R35.1 25.5,14.5 26.5,13.5 JP19.2
N$64
  Top 0.305: R33.1 C58.1 | R33.1 28.5,18.45 26.5,18.45 R35.2 | IC5.6 28.86,19.9 28.55,19.59 R33.1
N$65
  Top 0.305: IC5.7 30.14,19.9 30.45,19.59 R33.2 C58.2 R29.1
N$66
  Top 0.305: JP16.1 39.04,33.5 R28.2
N$67
  Top 0.305: JP16.2 C41.-
N$68
  Top 0.305: C48.+ R27.2
N$69
  Top 0.305: C41.+ R24.2
N$70
  Top 0.305: JP13.3 17.9,53.44 C30.-
  Bottom 0.305: J1.2 8.25,61.25 10,59.5 12.45,59.5 R20.2 12.5,54.5 14,53 14.04,53.04 JP13.3
N$71
  Top 0.305: C45.- 17.5,43.9 JP13.1
  Bottom 0.305: J2.2 12.3,47.25 R26.2 12.55,47.5 17.5,47.5 JP13.1
N$72
  Top 0.305: JP18.1 16.9,25.64 C59.-
  Bottom 0.305: J3.2 12.3,33.25 R34.2 12.5,27 14.46,25.04 JP18.1
N$73
  Top 0.305: C60.- 17.5,13.1 JP18.3
  Bottom 0.305: J4.2 8.15,19.45 R36.2 12.55,19.5 17.04,19.5 JP18.3
PVDD  (via drill 0.2, 0.2 pad 0.3)
  Bottom 0.813: C64.1 93,65.5 | C63.1 93,68 | C61.1 93.5,49.5 | C62.1 93.5,47
  other vias: 91.5,60.1 92.3,60.1 90.7,59.4 91.5,59.4 92.3,59.4 93.1,60.1 93.1,59.4 90.7,60.1 93.8,60.1 93.8,59.4 90.6,55.6 90.6,54.9 91.4,55.6 91.4,54.9 92.2,54.9 93,54.9 93.8,54.9 93.8,55.6 93,55.6 92.2,55.6
  pour Bottom (isolate 0.305, no thermals): 67,101 64,101 64,89 64.5,88.5 71,88.5 78,81.5 84,81.5 89.5,76 89.5,33.5 94,33.5 94,85 89.5,89.5 78.5,89.5
  pour Top (isolate 0.305, rank 2, no thermals): 94.05,60.45 88.9,60.45 88.65,60.2 88.65,59.35 89,59 94.05,59
  pour Top (isolate 0.305, rank 2, no thermals): 89.95,56 89.85,55.9 88.7,55.9 88.65,55.85 88.65,54.7 88.85,54.5 94.1,54.5 94.1,56
  pour Bottom (isolate 0.305, rank 2, no thermals): 94,31.35 94,44 81,31 81,28.4 83.2,26.2 88.85,26.2
  pour Bottom (isolate 0.305): 94,62.5 105.5,62.5 107,64 115,64 115.5,63.5 115.5,57.5 115,57 107,57 106,58 94,58
VMID  (via drill 0.35)
  Top 0.305: IC3.3 28.86,51.13 v29,51 | IC5.3 28.86,25.36 v28.5,25 | IC3.5 27.5,48 v26.45,48 | IC5.5 27.5,22 v26.5,22
  Bottom 0.305: C10.2 28.5,50.5 v29,51 | v28.5,25 28,24.5 C9.2 26.45,22.05 v26.5,22
  Bottom 0.813: R7.2 R8.2 26.55,50.6 C10.2 v26.45,48 C9.2

### Text on the board
tNames: PVDD | 12V | 3V3